# Altium schematic sheet led_pack.SchDoc
size A4
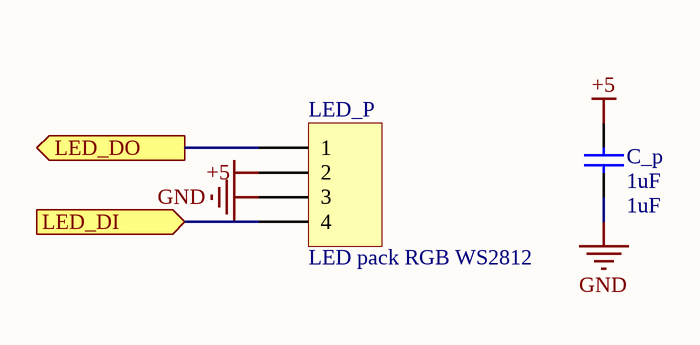
[diagram p0: led_pack.SchDoc]

## Parts
C_p  1uF  [0603C]
LED_P  LED pack RGB WS2812  [LED_PAKC_7]

## Ports
LED_DI (in), LED_DO (out)

## Nets
+5: C_p.2 LED_P.2
GND: C_p.1 LED_P.3
LED_DI: LED_P.4 ; port LED_DI
LED_DO: LED_P.1 ; port LED_DO

## Library data of the parts
C_p = Cap: CAP SMD 0603; Published: 8-Jun-2000; LatestRevisionDate: 17-Jul-2002; LatestRevisionNote: Re-released for DXP Platform.; PackageReference: RAD-0.3; Publisher: Altium Limited; PackageDescription: Radial Cap, Thru-Hole; 2 Leads; 0.3 in Pin Spacing; Value: 1uF
LED_P = Header 4: 7led-red white LED pack; LatestRevisionDate: 17-Jul-2002; LatestRevisionNote: Re-released for DXP Platform.; Publisher: Altium Limited